# Altium schematic sheet mcu.SchDoc
size A4
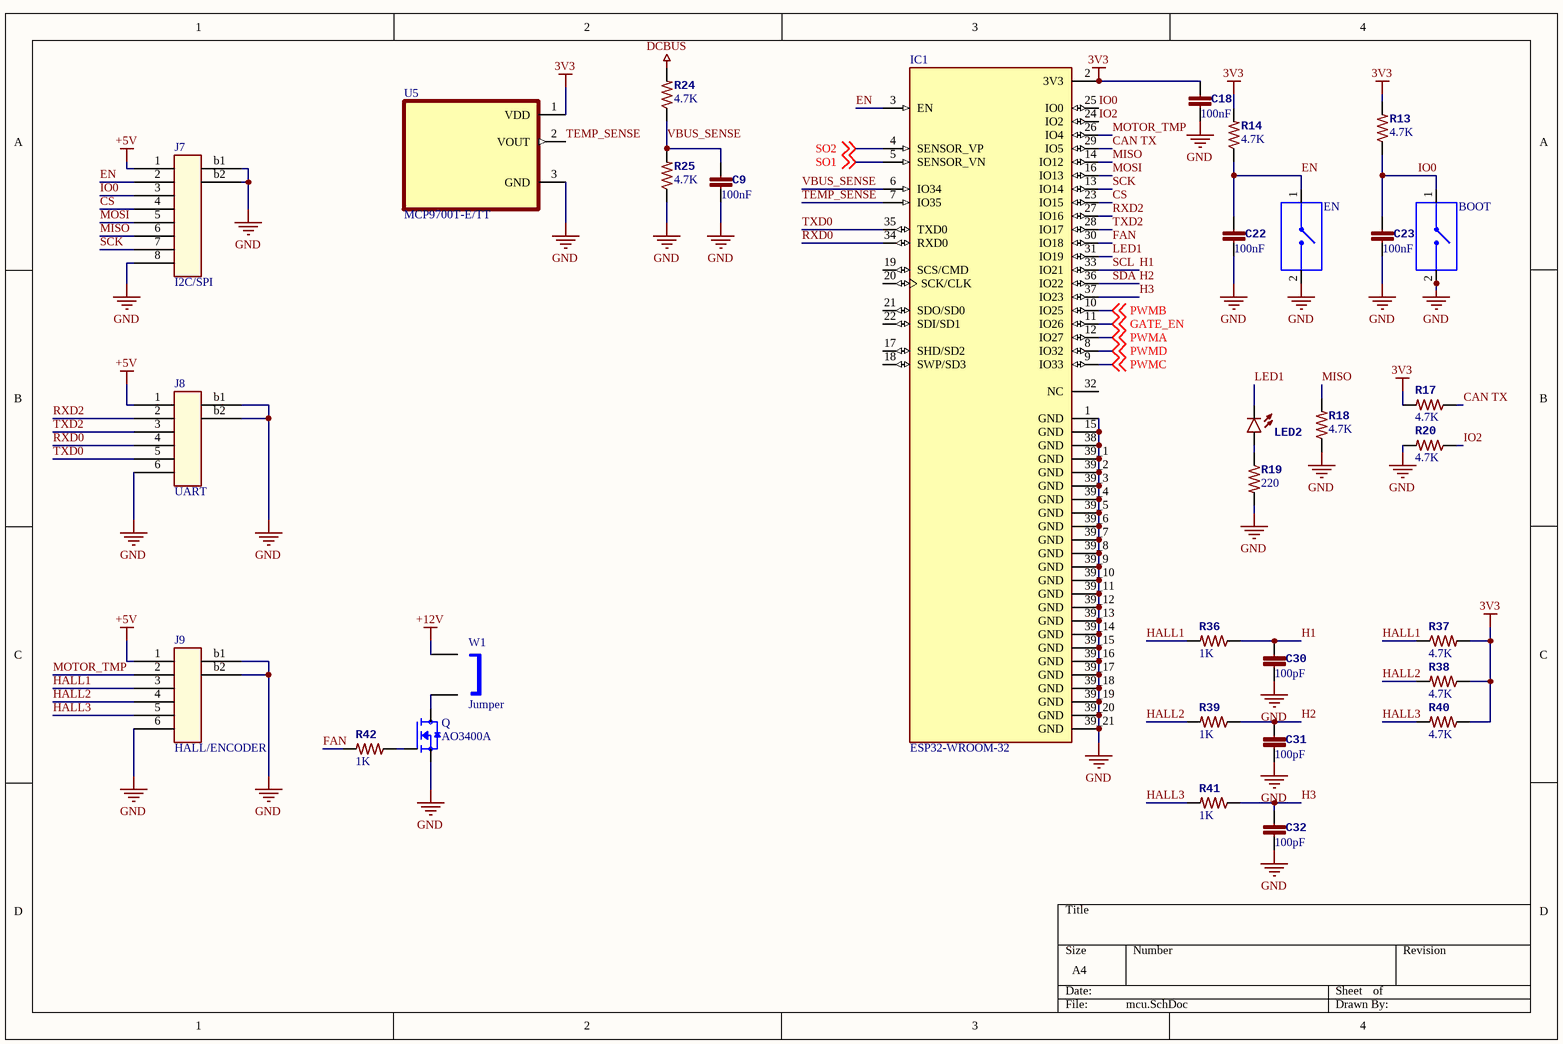
[diagram p0: mcu.SchDoc]

## Parts
BOOT  1437566-4  [SW_1437566-4]  (value not drawn)
C9  value 100nF  [_0805]  (hidden comment: Cap)
C18  value 100nF  [_0805]  (hidden comment: Cap)
C22  value 100nF  [_0805]  (hidden comment: Cap)
C23  value 100nF  [_0805]  (hidden comment: Cap)
C30  value 100pF  [_0805]  (hidden comment: Cap)
C31  value 100pF  [_0805]  (hidden comment: Cap)
C32  value 100pF  [_0805]  (hidden comment: Cap)
EN  1437566-4  [SW_1437566-4]  (value not drawn)
IC1  ESP32-WROOM-32  [MODULE_ESP32-WROOM-32]
J7  I2C/SPI  [JST_FH_8P]
J8  UART  [JST_FH_6P]
J9  HALL/ENCODER  [JST_FH_6P]
LED2  LED  [_LED-0805]  (value not drawn)
Q  AO3400A  [SOT95P280X125-3N]
R13  value 4.7K  [_0805]  (hidden comment: Resistor)
R14  value 4.7K  [_0805]  (hidden comment: Resistor)
R17  value 4.7K  [_0805]  (hidden comment: Resistor)
R18  value 4.7K  [_0805]  (hidden comment: Resistor)
R19  value 220  [_0805]  (hidden comment: Resistor)
R20  value 4.7K  [_0805]  (hidden comment: Resistor)
R24  value 4.7K  [_0805]  (hidden comment: Resistor)
R25  value 4.7K  [_0805]  (hidden comment: Resistor)
R36  value 1K  [_0805]  (hidden comment: Resistor)
R37  value 4.7K  [_0805]  (hidden comment: Resistor)
R38  value 4.7K  [_0805]  (hidden comment: Resistor)
R39  value 1K  [_0805]  (hidden comment: Resistor)
R40  value 4.7K  [_0805]  (hidden comment: Resistor)
R41  value 1K  [_0805]  (hidden comment: Resistor)
R42  value 1K  [_0805]  (hidden comment: Resistor)
U5  MCP9700T-E/TT  [SOT95P237X112-3N]
W1  Jumper  [My_IDC-2]

## Nets
3V3: C18.1 IC1.2(3V3) R13.2 R14.2 R17.2 R37.2 R38.1 R40.1 U5.1(VDD)
+5V: J7.1 J8.1 J9.1
+12V: W1.1
DCBUS: R24.2
GND: BOOT.2 C9.2 C18.2 C22.2 C23.2 C30.2 C31.2 C32.2 EN.2 IC1.1(GND) IC1.15(GND) IC1.38(GND) IC1.39_1(GND) IC1.39_2(GND) IC1.39_3(GND) IC1.39_4(GND) IC1.39_5(GND) IC1.39_6(GND) IC1.39_7(GND) IC1.39_8(GND) IC1.39_9(GND) IC1.39_10(GND) IC1.39_11(GND) IC1.39_12(GND) IC1.39_13(GND) IC1.39_14(GND) IC1.39_15(GND) IC1.39_16(GND) IC1.39_17(GND) IC1.39_18(GND) IC1.39_19(GND) IC1.39_20(GND) IC1.39_21(GND) J7.8 J7.b1 J7.b2 J8.6 J8.b1 J8.b2 J9.6 J9.b1 J9.b2 Q.2(S) R18.1 R19.2 R20.2 R25.1 U5.3(GND)
CAN TX: IC1.29(IO5) R17.1
CS: IC1.23(IO15) J7.4
EN: C22.1 EN.1 IC1.3(EN) J7.2 R14.1
FAN: IC1.30(IO18) R42.2
GATE_EN: IC1.11(IO26) ; off-sheet GATE_EN
H1: C30.1 IC1.33(IO21) R36.1  [also labelled SCL]
H2: C31.1 IC1.36(IO22) R39.1  [also labelled SDA]
H3: C32.1 IC1.37(IO23) R41.1
HALL1: J9.3 R36.2 R37.1
HALL2: J9.4 R38.2 R39.2
HALL3: J9.5 R40.2 R41.2
IO0: BOOT.1 C23.1 IC1.25(IO0) J7.3 R13.1
IO2: IC1.24(IO2) R20.1
LED1: IC1.31(IO19) LED2.K
MISO: IC1.14(IO12) J7.6 R18.2
MOSI: IC1.16(IO13) J7.5
MOTOR_TMP: IC1.26(IO4) J9.2
PWMA: IC1.12(IO27) ; off-sheet PWMA
PWMB: IC1.10(IO25) ; off-sheet PWMB
PWMC: IC1.9(IO33) ; off-sheet PWMC
PWMD: IC1.8(IO32) ; off-sheet PWMD
RXD0: IC1.34(RXD0) J8.4
RXD2: IC1.27(IO16) J8.2
SCK: IC1.13(IO14) J7.7
SO1: IC1.5(SENSOR_VN) ; off-sheet SO1
SO2: IC1.4(SENSOR_VP) ; off-sheet SO2
TEMP_SENSE: IC1.7(IO35) U5.2(VOUT)
TXD0: IC1.35(TXD0) J8.5
TXD2: IC1.28(IO17) J8.3
VBUS_SENSE: C9.1 IC1.6(IO34) R24.1 R25.2
NetLED2_A: LED2.A R19.1
NetQ_1: Q.1(G) R42.1
NetQ_3: Q.3(D) W1.2

Not connected (* = marked no-connect by the designer): IC1 17(SHD/SD2) 18(SWP/SD3) 19(SCS/CMD) 20(SCK/CLK) 21(SDO/SD0) 22(SDI/SD1) 32(NC)

## Library data of the parts
BOOT EN = 1437566-4: Switch Tactile OFF _ON_ SPST Rectangular Button Gull Wing 0.05A 12VDC 1.77N SMD T/R; MF: TE Connectivity; Configuration_Pole-Throw: Single Pole - Single Throw; Contact_Current_Rating: 50 mA; MP: FSMSMTR; Package: None; Digi-Key_Part_Number: 450-1758-1-ND; Digi-Key_Purchase_URL: https://www.digikey.com/product-detail/en/te-connectivity-alcoswitch-switches/FSMSMTR/450-1758-1-ND/2271637?utm_source=snapeda&utm_medium=aggregator&utm_campaign=symbol; Value: *; TE_purchase_URL: https://www.te.com/usa-en/product-1437566-4.html?te_bu=Cor&te_type=disp&te_campaign=seda_glo_cor-seda-global-disp-prtnr-fy19-seda-model-bom-cta_sma-317_1&elqCampaignId=32493; SnapEDA_Link: https://www.snapeda.com/parts/FSMSMTR/TE%20Connectivity%20ALCOSWITCH%20Switches/view-part/2118497/?ref=snap
C9 C18 C22 C23 C30-C32 = Cap_1
IC1 = ESP32-WROOM-32: Bluetooth, WiFi 802.11b/g/n, Bluetooth v4.2 +EDR, Class 1, 2 and 3 Transceiver Module 2.4GHz ~ 2.5GHz Antenna Not Included, U.FL Surface Mount; MF: Espressif Systems; MP: ESP32-WROOM-32; Purchase-URL: https://pricing.snapeda.com/search/part/ESP32-WROOM-32/?ref=eda; Package: Module Espressif Systems; Value: *; Digi-Key_Part_Number: 1965-ESP32-WROOM-32U-N4CT-ND; Check_prices: https://www.snapeda.com/parts/ESP32-WROOM-32/Espressif+Systems/view-part/?ref=eda; SnapEDA_Link: https://www.snapeda.com/parts/ESP32-WROOM-32/Espressif+Systems/view-part/?ref=snap
J7 = JST_FH_8P
J8 J9 = JST_FH_6P
LED2 = LED: PROD_ID: DIO-09955
Q = AO3400A: N-Channel 30V 5.7A _Ta_ 1.4W _Ta_ Surface Mount SOT-23-3L; MF: Alpha &; Package: SOT-23 Alpha &amp; Omega Semiconductor; Value: *; Price: None; MP: AO3400A; Availability: Unavailable; SnapEDA_Link: https://www.snapeda.com/parts/AO3400A/Alpha%20%26%20Omega%20Semiconductor%20Inc./view-part/405248/?ref=snap
U5 = MCP9700T-E/TT: Temperature Sensor Analog, Local -40Â°C ~ 125Â°C 10mV/Â°C SOT-23-3; MF: Microchip; Value: *; Price: None; Package: SOT-23-3 Microchip; SnapEDA_Link: https://www.snapeda.com/parts/MCP9700T-E/TT/Microchip/view-part/134539/?ref=snap; Availability: Unavailable; MP: MCP9700T-E/TT
W1 = Jumper: Jumper Wire; Manufacturer: Generic Components; Published: 1999